# Altium schematic sheet MCU_System.SchDoc
size A
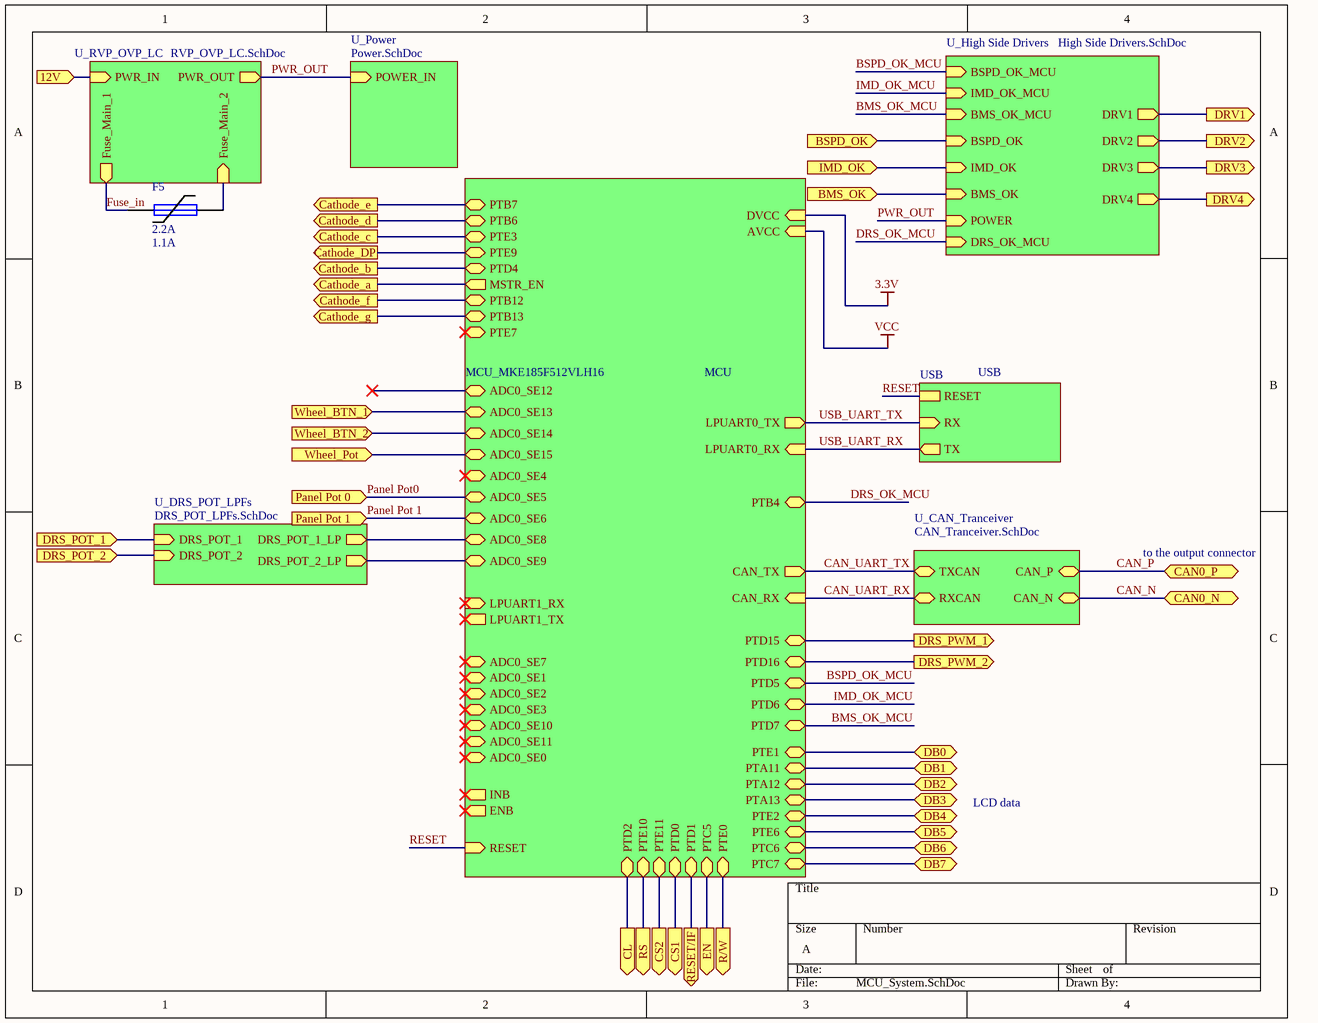
[diagram p0: MCU_System.SchDoc]

## Parts
F5  2.2A  I_hold: 1.1A  [PTC Fuse 1206/3216]

## Sub-sheets
MCU = MCU_MKE185F512VLH16: LPUART1_RX (in), LPUART0_TX (out), LPUART0_RX (in), RESET (in), PTD6 (bidir), PTD7 (bidir), PTD5 (bidir), PTD15 (bidir), PTD16 (bidir), INB (out), ADC0_SE6 (bidir), ADC0_SE7 (bidir), ADC0_SE8 (bidir), ADC0_SE1 (bidir), ADC0_SE13 (bidir), ADC0_SE14 (bidir), ADC0_SE10 (bidir), ADC0_SE11 (bidir), ENB (out), ADC0_SE0 (bidir), ADC0_SE9 (bidir), ADC0_SE12 (bidir), ADC0_SE15 (bidir), PTB4 (bidir), AVCC (in), DVCC (in), ADC0_SE5 (bidir), MSTR_EN (out), ADC0_SE2 (bidir), ADC0_SE3 (bidir), ADC0_SE4 (bidir), PTE11 (bidir), PTE10 (bidir), PTB7 (bidir), PTB6 (bidir), PTE3 (bidir), PTE9 (bidir), PTE6 (bidir), PTC6 (bidir), PTC7 (bidir), PTD1 (bidir), PTD0 (bidir), PTA11 (bidir), PTA12 (bidir), PTA13 (bidir), PTD2 (bidir), PTE0 (bidir), PTE1 (bidir), PTE2 (bidir), PTB12 (bidir), PTB13 (bidir), PTD4 (bidir), PTC5 (bidir), PTE7 (bidir), LPUART1_TX (out), CAN_RX (in), CAN_TX (out)
U_CAN_Tranceiver = CAN_Tranceiver.SchDoc: TXCAN (bidir), RXCAN (bidir), CAN_N (bidir), CAN_P (bidir)
U_DRS_POT_LPFs = DRS_POT_LPFs.SchDoc: DRS_POT_1_LP (out), DRS_POT_1 (in), DRS_POT_2_LP (out), DRS_POT_2 (in)
U_High Side Drivers = High Side Drivers.SchDoc: BSPD_OK (in), IMD_OK (in), BMS_OK (in), DRV2 (out), DRV1 (out), DRV3 (out), BMS_OK_MCU (in), BSPD_OK_MCU (in), IMD_OK_MCU (in), POWER (in), DRS_OK_MCU (in), DRV4 (out)
U_Power = Power.SchDoc: POWER_IN (in)
U_RVP_OVP_LC = RVP_OVP_LC.SchDoc: PWR_IN (in), PWR_OUT (out), Fuse_Main_2 (in), Fuse_Main_1 (out)
USB = USB: TX (out), RX (in), RESET

## Ports
12V (in), BMS_OK (in), BSPD_OK (in), CAN0_N (bidir), CAN0_P (bidir), Cathode_a (out), Cathode_b (out), Cathode_c (out), Cathode_d (out), Cathode_DP (out), Cathode_e (out), Cathode_f (out), Cathode_g (out), CL (out), CS1 (out), CS2 (out), DB0 (bidir), DB1 (bidir), DB2 (bidir), DB3 (bidir), DB4 (bidir), DB5 (bidir), DB6 (bidir), DB7 (bidir), DRS_POT_1 (in), DRS_POT_2 (in), DRS_PWM_1 (out), DRS_PWM_2 (out), DRV1 (out), DRV2 (out), DRV3 (out), DRV4 (out), EN (out), IMD_OK (in), Panel Pot 0 (in), Panel Pot 1 (in), R/W (out), RESET/IF (out), RS (out), Wheel_BTN_1 (in), Wheel_BTN_2 (in), Wheel_Pot (in)

## Nets
3.3V: sheet MCU/DVCC
VCC: sheet MCU/AVCC
12V: port 12V, sheet U_RVP_OVP_LC/PWR_IN
BMS_OK: port BMS_OK, sheet U_High Side Drivers/BMS_OK
BMS_OK_MCU: sheet MCU/PTD7, sheet U_High Side Drivers/BMS_OK_MCU
BSPD_OK: port BSPD_OK, sheet U_High Side Drivers/BSPD_OK
BSPD_OK_MCU: sheet MCU/PTD5, sheet U_High Side Drivers/BSPD_OK_MCU
CAN_N: port CAN0_N, sheet U_CAN_Tranceiver/CAN_N
CAN_P: port CAN0_P, sheet U_CAN_Tranceiver/CAN_P
CAN_UART_RX: sheet MCU/CAN_RX, sheet U_CAN_Tranceiver/RXCAN
CAN_UART_TX: sheet MCU/CAN_TX, sheet U_CAN_Tranceiver/TXCAN
Cathode_a: port Cathode_a, sheet MCU/MSTR_EN
Cathode_b: port Cathode_b, sheet MCU/PTD4
Cathode_c: port Cathode_c, sheet MCU/PTE3
Cathode_d: port Cathode_d, sheet MCU/PTB6
Cathode_DP: port Cathode_DP, sheet MCU/PTE9
Cathode_e: port Cathode_e, sheet MCU/PTB7
Cathode_f: port Cathode_f, sheet MCU/PTB12
Cathode_g: port Cathode_g, sheet MCU/PTB13
CL: port CL, sheet MCU/PTD2
CS1: port CS1, sheet MCU/PTD0
CS2: port CS2, sheet MCU/PTE11
DB0: port DB0, sheet MCU/PTE1
DB1: port DB1, sheet MCU/PTA11
DB2: port DB2, sheet MCU/PTA12
DB3: port DB3, sheet MCU/PTA13
DB4: port DB4, sheet MCU/PTE2
DB5: port DB5, sheet MCU/PTE6
DB6: port DB6, sheet MCU/PTC6
DB7: port DB7, sheet MCU/PTC7
DRS_OK_MCU: sheet MCU/PTB4, sheet U_High Side Drivers/DRS_OK_MCU
DRS_POT_1: port DRS_POT_1, sheet U_DRS_POT_LPFs/DRS_POT_1
DRS_POT_2: port DRS_POT_2, sheet U_DRS_POT_LPFs/DRS_POT_2
DRS_PWM_1: port DRS_PWM_1, sheet MCU/PTD15
DRS_PWM_2: port DRS_PWM_2, sheet MCU/PTD16
DRV1: port DRV1, sheet U_High Side Drivers/DRV1
DRV2: port DRV2, sheet U_High Side Drivers/DRV2
DRV3: port DRV3, sheet U_High Side Drivers/DRV3
DRV4: port DRV4, sheet U_High Side Drivers/DRV4
EN: port EN, sheet MCU/PTC5
Fuse_in: F5.1 ; sheet U_RVP_OVP_LC/Fuse_Main_1
IMD_OK: port IMD_OK, sheet U_High Side Drivers/IMD_OK
IMD_OK_MCU: sheet MCU/PTD6, sheet U_High Side Drivers/IMD_OK_MCU
Panel Pot0: port Panel Pot 0, sheet MCU/ADC0_SE5
Panel Pot 1: port Panel Pot 1, sheet MCU/ADC0_SE6
PWR_OUT: sheet U_RVP_OVP_LC/PWR_OUT, sheet U_Power/POWER_IN, sheet U_High Side Drivers/POWER
R/W: port R/W, sheet MCU/PTE0
RESET: sheet MCU/RESET, sheet USB/RESET
RESET/IF: port RESET/IF, sheet MCU/PTD1
RS: port RS, sheet MCU/PTE10
USB_UART_RX: sheet MCU/LPUART0_RX, sheet USB/TX
USB_UART_TX: sheet MCU/LPUART0_TX, sheet USB/RX
Wheel_BTN_1: port Wheel_BTN_1, sheet MCU/ADC0_SE13
Wheel_BTN_2: port Wheel_BTN_2, sheet MCU/ADC0_SE14
Wheel_Pot: port Wheel_Pot, sheet MCU/ADC0_SE15
NetF5_2: F5.2 ; sheet U_RVP_OVP_LC/Fuse_Main_2
(unnamed): sheet MCU/ADC0_SE8, sheet U_DRS_POT_LPFs/DRS_POT_1_LP
(unnamed): sheet MCU/ADC0_SE9, sheet U_DRS_POT_LPFs/DRS_POT_2_LP

## Notes on the sheet
- to the output connector
- LCD data

## Library data of the parts
F5 = 8: Fuse; Manufacturer_id: 1; MfrPartNo: 1206L110/12SLYR; idFuse: 8; Name: Resettable; I_max: 50A; V_max: 12V; Pd_Typ: .8W; Published: 8-Jun-2000; LatestRevisionDate: 17-Jul-2002; LatestRevisionNote: Re-released for DXP Platform.; PackageReference: PIN-W2/E2.8; Publisher: Altium Limited; PackageDescription: Thru-Hole; 2 Leads; Drawer_id: 1; I_trip: 2.2A; Link: https://www.digikey.com/product-detail/en/littelfuse-inc/1206L110-12SLYR/F5764CT-ND/3593809